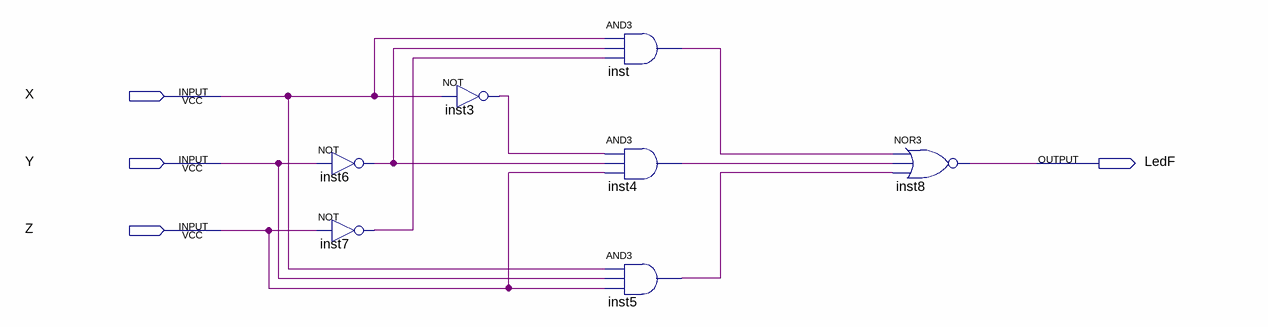
[diagram p0: schematic sheet]
// Quartus schematic LEDf.bdf as structural Verilog: 7 symbols, 4 pins
module LEDf (
  input  X,
  input  Y,
  input  Z,
  output LedF
);

  wire inst3_out, inst4_out, inst5_out, inst6_out, inst7_out, inst_out;

  not inst6 (inst6_out, Y);
  not inst7 (inst7_out, Z);
  not inst3 (inst3_out, X);
  and inst (inst_out, X, inst6_out, inst7_out);
  and inst4 (inst4_out, inst3_out, inst6_out, Z);
  and inst5 (inst5_out, X, Y, Z);
  nor inst8 (LedF, inst_out, inst4_out, inst5_out);
endmodule
